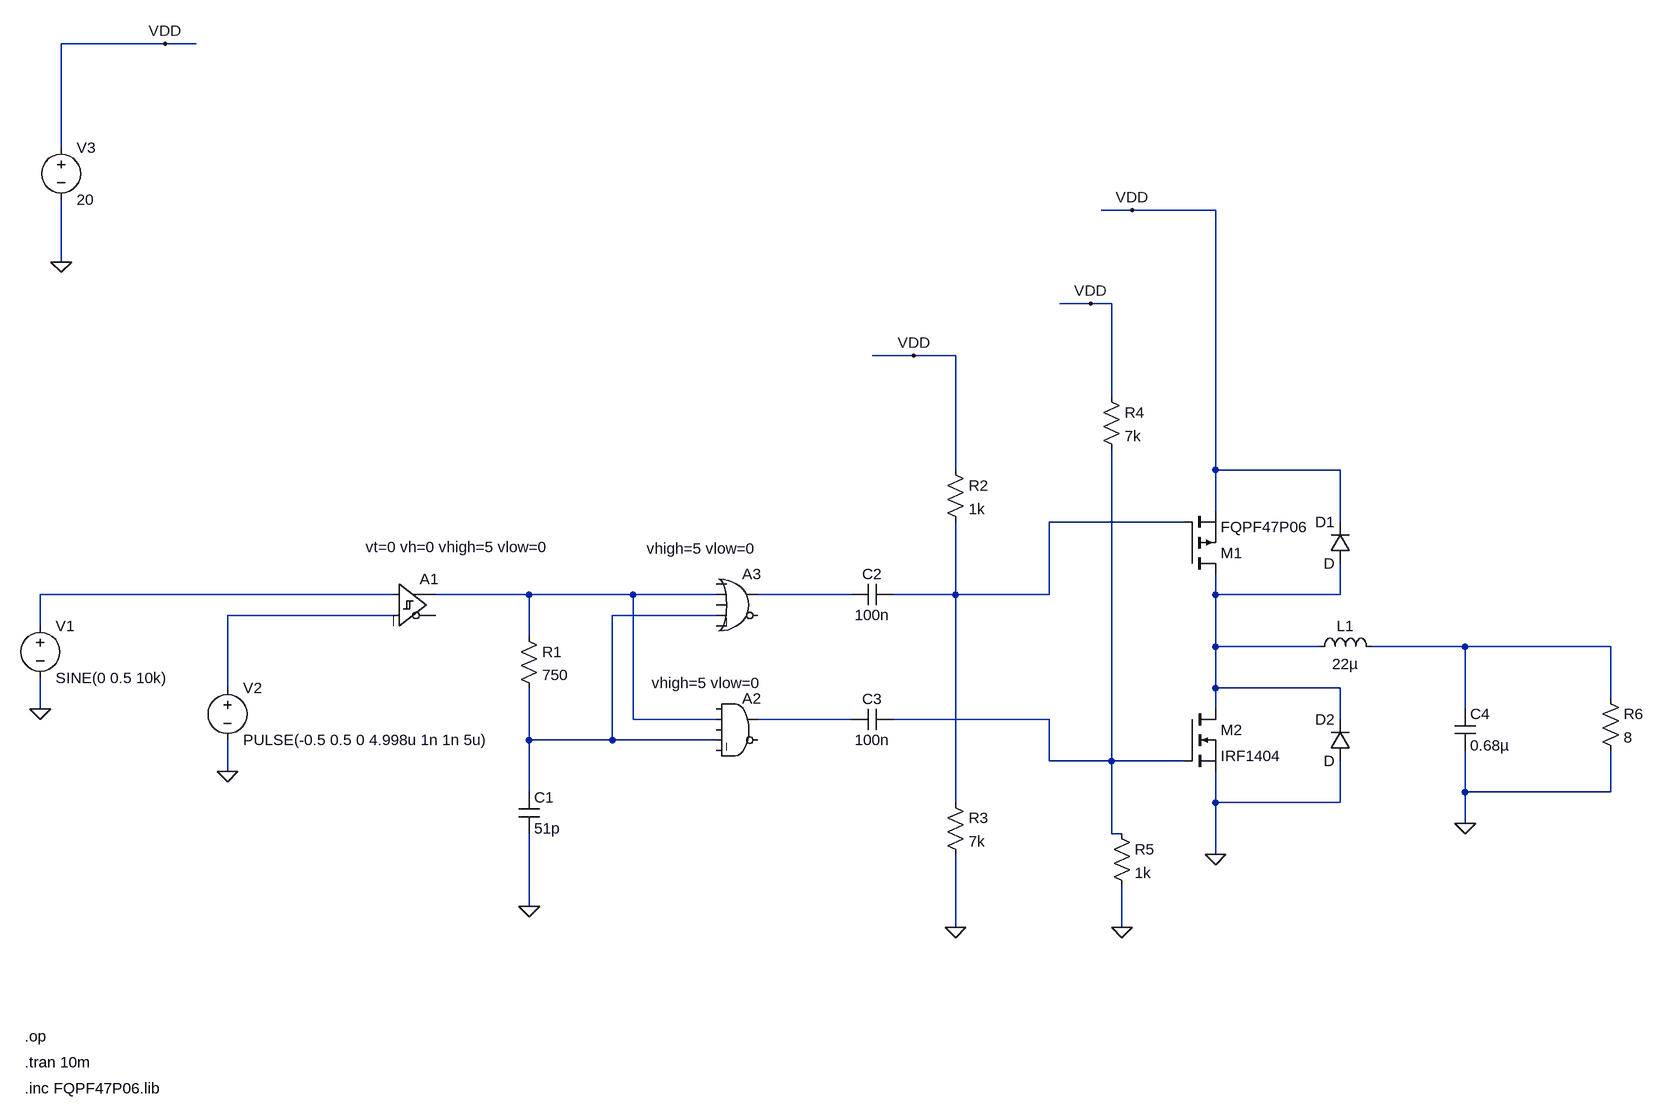
[diagram p0: schematic ClassDAmplifierHalfBridgeSimulationAlt.asc]
ClassDAmplifierHalfBridgeSimulationAlt.asc, the LTspice schematic file:
Version 4
SHEET 1 1208 920
WIRE -1072 -704 -1232 -704
WIRE -1024 -704 -1072 -704
WIRE -1232 -544 -1232 -704
WIRE 416 -448 368 -448
WIRE 544 -448 416 -448
WIRE -1232 -368 -1232 -464
WIRE 352 -304 304 -304
WIRE 384 -304 352 -304
WIRE 80 -224 16 -224
WIRE 144 -224 80 -224
WIRE 384 -160 384 -304
WIRE 144 -48 144 -224
WIRE 544 -48 544 -448
WIRE 736 -48 544 -48
WIRE 544 16 544 -48
WIRE 496 32 288 32
WIRE 736 32 736 -48
WIRE -720 144 -1264 144
WIRE -512 144 -656 144
WIRE -352 144 -512 144
WIRE -224 144 -352 144
WIRE -16 144 -160 144
WIRE 144 144 144 32
WIRE 144 144 48 144
WIRE 288 144 288 32
WIRE 288 144 144 144
WIRE 544 144 544 112
WIRE 736 144 736 96
WIRE 736 144 544 144
WIRE -720 176 -976 176
WIRE -224 176 -384 176
WIRE -1264 192 -1264 144
WIRE -512 208 -512 144
WIRE 544 224 544 144
WIRE 704 224 544 224
WIRE 928 224 784 224
WIRE 1152 224 928 224
WIRE -976 288 -976 176
WIRE 544 288 544 224
WIRE 736 288 544 288
WIRE 1152 304 1152 224
WIRE -1264 320 -1264 272
WIRE 544 320 544 288
WIRE 928 320 928 224
WIRE -352 336 -352 144
WIRE -224 336 -352 336
WIRE -16 336 -160 336
WIRE 288 336 48 336
WIRE 736 336 736 288
WIRE -512 368 -512 288
WIRE -384 368 -384 176
WIRE -384 368 -512 368
WIRE -224 368 -384 368
WIRE 288 400 288 336
WIRE 384 400 384 -80
WIRE 384 400 288 400
WIRE 496 400 384 400
WIRE -976 416 -976 368
WIRE -512 448 -512 368
WIRE 928 448 928 384
WIRE 1152 448 1152 384
WIRE 1152 448 928 448
WIRE 144 464 144 144
WIRE 544 464 544 416
WIRE 736 464 736 400
WIRE 736 464 544 464
WIRE 928 496 928 448
WIRE 384 512 384 400
WIRE 400 512 384 512
WIRE 544 544 544 464
WIRE -512 624 -512 512
WIRE 144 656 144 544
WIRE 400 656 400 592
FLAG -976 416 0
FLAG -1264 320 0
FLAG -512 624 0
FLAG 544 544 0
FLAG 416 -448 VDD
FLAG 400 656 0
FLAG 144 656 0
FLAG 80 -224 VDD
FLAG 352 -304 VDD
FLAG 928 496 0
FLAG -1232 -368 0
FLAG -1072 -704 VDD
SYMBOL Digital\\diffschmitt -720 96 R0
WINDOW 3 -43 -25 Left 2
SYMATTR Value vt=0 vh=0 vhigh=5 vlow=0
SYMATTR InstName A1
SYMBOL voltage -1264 176 R0
WINDOW 123 0 0 Left 0
WINDOW 39 0 0 Left 0
SYMATTR InstName V1
SYMATTR Value SINE(0 0.5 10k)
SYMBOL voltage -976 272 R0
WINDOW 123 0 0 Left 0
WINDOW 39 0 0 Left 0
SYMATTR InstName V2
SYMATTR Value PULSE(-0.5 0.5 0 4.998u 1n 1n 5u)
SYMBOL Digital\\and -192 288 R0
WINDOW 3 -131 -8 Left 2
SYMATTR Value vhigh=5 vlow=0
SYMATTR InstName A2
SYMBOL Digital\\or -192 96 R0
WINDOW 3 -139 -23 Left 2
SYMATTR Value vhigh=5 vlow=0
SYMATTR InstName A3
SYMBOL res -528 192 R0
SYMATTR InstName R1
SYMATTR Value 750
SYMBOL cap -528 448 R0
SYMATTR InstName C1
SYMATTR Value 51p
SYMBOL cap 48 128 R90
WINDOW 0 0 32 VBottom 2
WINDOW 3 32 32 VTop 2
SYMATTR InstName C2
SYMATTR Value 100n
SYMBOL cap 48 320 R90
WINDOW 0 0 32 VBottom 2
WINDOW 3 32 32 VTop 2
SYMATTR InstName C3
SYMATTR Value 100n
SYMBOL pmos 496 112 M180
SYMATTR InstName M1
SYMATTR Value FQPF47P06
SYMATTR Prefix X
SYMBOL nmos 496 320 R0
SYMATTR InstName M2
SYMATTR Value IRF1404
SYMBOL res 128 -64 R0
SYMATTR InstName R2
SYMATTR Value 1k
SYMBOL res 128 448 R0
SYMATTR InstName R3
SYMATTR Value 7k
SYMBOL res 368 -176 R0
SYMATTR InstName R4
SYMATTR Value 7k
SYMBOL res 384 496 R0
SYMATTR InstName R5
SYMATTR Value 1k
SYMBOL ind 688 240 R270
WINDOW 0 32 56 VTop 2
WINDOW 3 5 56 VBottom 2
SYMATTR InstName L1
SYMATTR Value 22µ
SYMBOL cap 912 320 R0
SYMATTR InstName C4
SYMATTR Value 0.68µ
SYMBOL res 1136 288 R0
SYMATTR InstName R6
SYMATTR Value 8
SYMBOL diode 752 96 R180
WINDOW 0 24 64 Left 2
WINDOW 3 24 0 Left 2
SYMATTR InstName D1
SYMBOL diode 752 400 R180
WINDOW 0 24 64 Left 2
WINDOW 3 24 0 Left 2
SYMATTR InstName D2
SYMBOL voltage -1232 -560 R0
WINDOW 123 0 0 Left 0
WINDOW 39 0 0 Left 0
SYMATTR InstName V3
SYMATTR Value 20
TEXT -1288 824 Left 2 !.op
TEXT -1288 864 Left 2 !.tran 10m
TEXT -1288 904 Left 2 !.inc FQPF47P06.lib

The netlist it stands for:
* ClassDAmplifierHalfBridgeSimulationAlt.asc
A1 N002 N006 0 0 0 0 N003 0 SCHMITT vt=0 vh=0 vhigh=5 vlow=0
V1 N002 0 SINE(0 0.5 10k)
V2 N006 0 PULSE(-0.5 0.5 0 4.998u 1n 1n 5u)
A2 0 N003 0 N007 0 0 N009 0 AND vhigh=5 vlow=0
A3 0 N003 0 N007 0 0 N004 0 OR vhigh=5 vlow=0
R1 N003 N007 750
C1 N007 0 51p
C2 N001 N004 100n
C3 N010 N009 100n
XM1 N005 N001 VDD FQPF47P06  ; pins D G S
M2 N005 N010 0 0 IRF1404
R2 VDD N001 1k
R3 N001 0 7k
R4 VDD N010 7k
R5 N010 0 1k
L1 N005 N008 22µ
C4 N008 0 0.68µ
R6 N008 0 8
D1 N005 VDD D
D2 0 N005 D
V3 VDD 0 20
.model D D
.lib standard.dio
.model NMOS NMOS
.model PMOS PMOS
.lib standard.mos
.op
.tran 10m
.inc FQPF47P06.lib
.backanno
.end